# EAGLE design Solar battery (EAGLE 9.6.2)
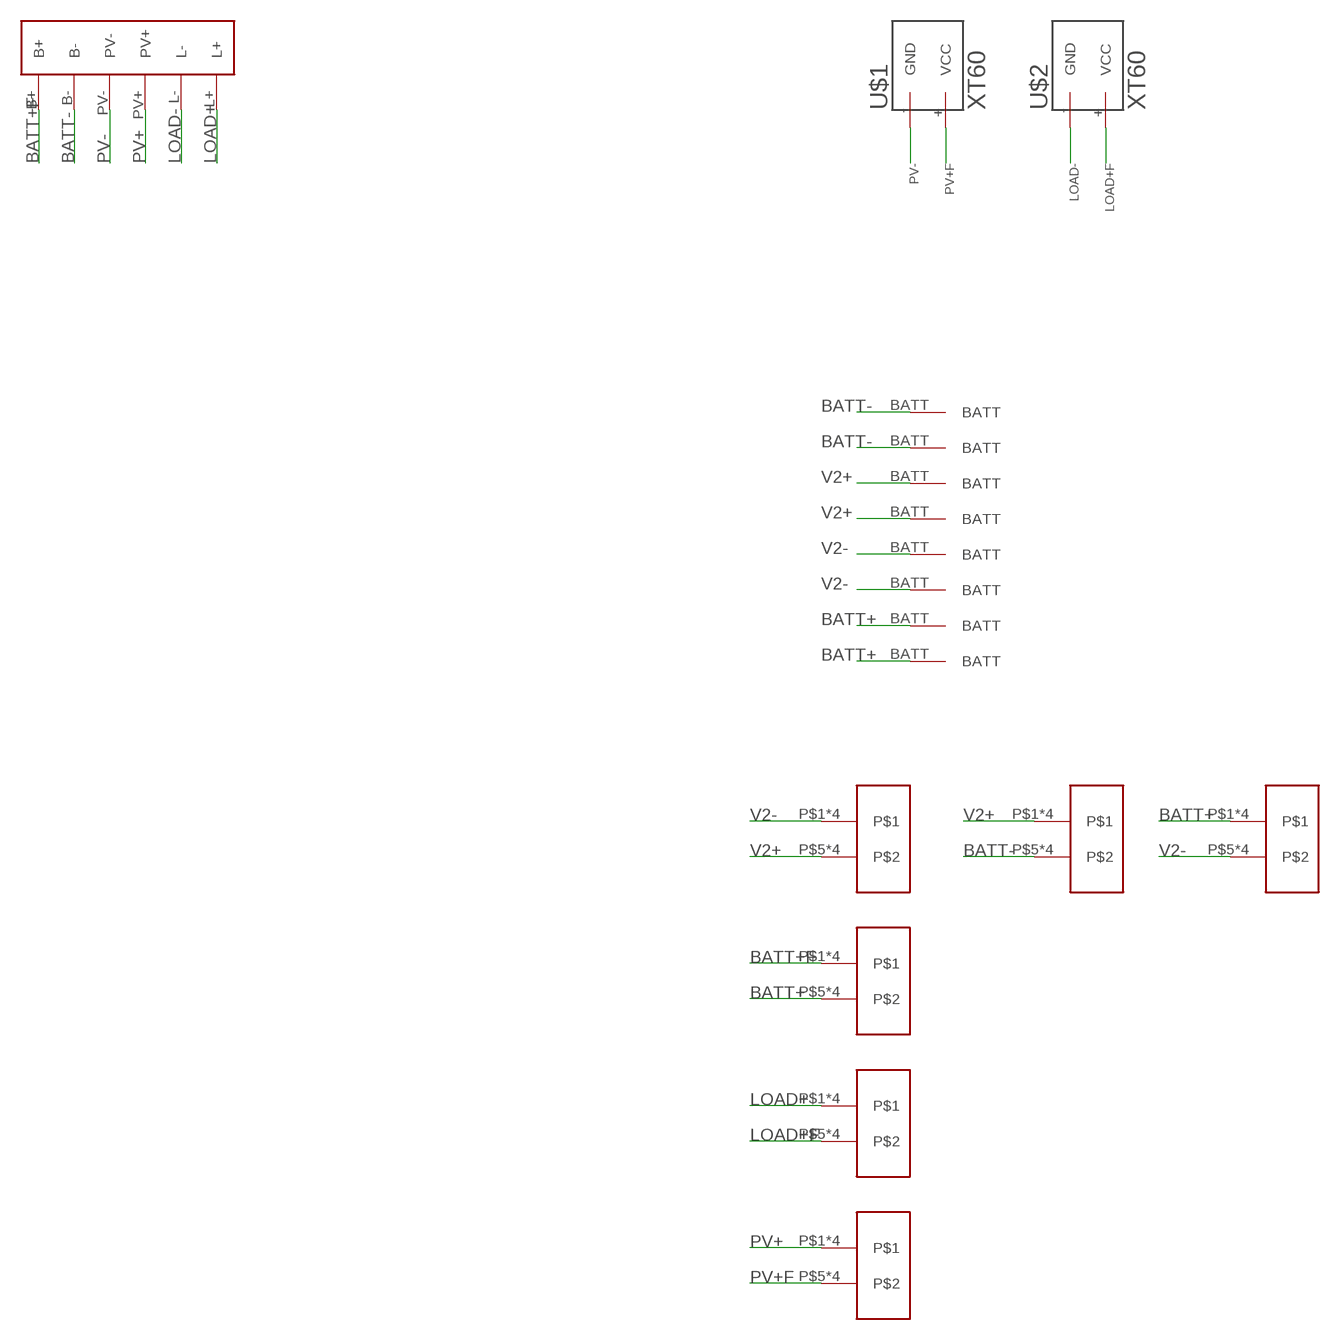
[diagram p0: schematic, sheet 1]

## Parts
U$1  XT60  [XT60]
U$2  XT60  [XT60]
U$3  C40_40135  [C40_40135]
U$4  C40_40135  [C40_40135]
U$5  C40_40135  [C40_40135]
U$6  C40_40135  [C40_40135]
U$7  C40_40135  [C40_40135]
U$8  C40_40135  [C40_40135]
U$9  C40_40135  [C40_40135]
U$10  C40_40135  [C40_40135]
U$11  FUSEHOLDER_178.6164  [FUSEHOLDER_178.6164]
U$12  FUSEHOLDER_178.6164  [FUSEHOLDER_178.6164]
U$13  FUSEHOLDER_178.6164  [FUSEHOLDER_178.6164]
U$14  FUSEHOLDER_178.6164  [FUSEHOLDER_178.6164]
U$15  FUSEHOLDER_178.6164  [FUSEHOLDER_178.6164]
U$16  FUSEHOLDER_178.6164  [FUSEHOLDER_178.6164]
U$17  SMARTSOLAR_75/15  [SMARTSOLAR_75/15]

## Nets
BATT+: U$9.BATT U$10.BATT U$12.P$5 U$12.P$6 U$12.P$7 U$12.P$8 U$16.P$1 U$16.P$2 U$16.P$3 U$16.P$4
BATT+F: U$12.P$1 U$12.P$2 U$12.P$3 U$12.P$4 U$17.B+
BATT-: U$3.BATT U$4.BATT U$15.P$5 U$15.P$6 U$15.P$7 U$15.P$8 U$17.B-
LOAD+: U$13.P$1 U$13.P$2 U$13.P$3 U$13.P$4 U$17.L+
LOAD+F: U$2.+(VCC) U$13.P$5 U$13.P$6 U$13.P$7 U$13.P$8
LOAD-: U$2.-(GND) U$17.L-
PV+: U$14.P$1 U$14.P$2 U$14.P$3 U$14.P$4 U$17.PV+
PV+F: U$1.+(VCC) U$14.P$5 U$14.P$6 U$14.P$7 U$14.P$8
PV-: U$1.-(GND) U$17.PV-
V2+: U$5.BATT U$6.BATT U$11.P$5 U$11.P$6 U$11.P$7 U$11.P$8 U$15.P$1 U$15.P$2 U$15.P$3 U$15.P$4
V2-: U$7.BATT U$8.BATT U$11.P$1 U$11.P$2 U$11.P$3 U$11.P$4 U$16.P$5 U$16.P$6 U$16.P$7 U$16.P$8

## Library data of the parts
U$1 U$2 = XT60:XT60: XT60
U$3-U$10 = Solar battery:C40_40135: C40 40135 Battery
U$11-U$16 = Solar battery:FUSEHOLDER_178.6164
U$17 = Solar battery:SMARTSOLAR_75/15

## Board
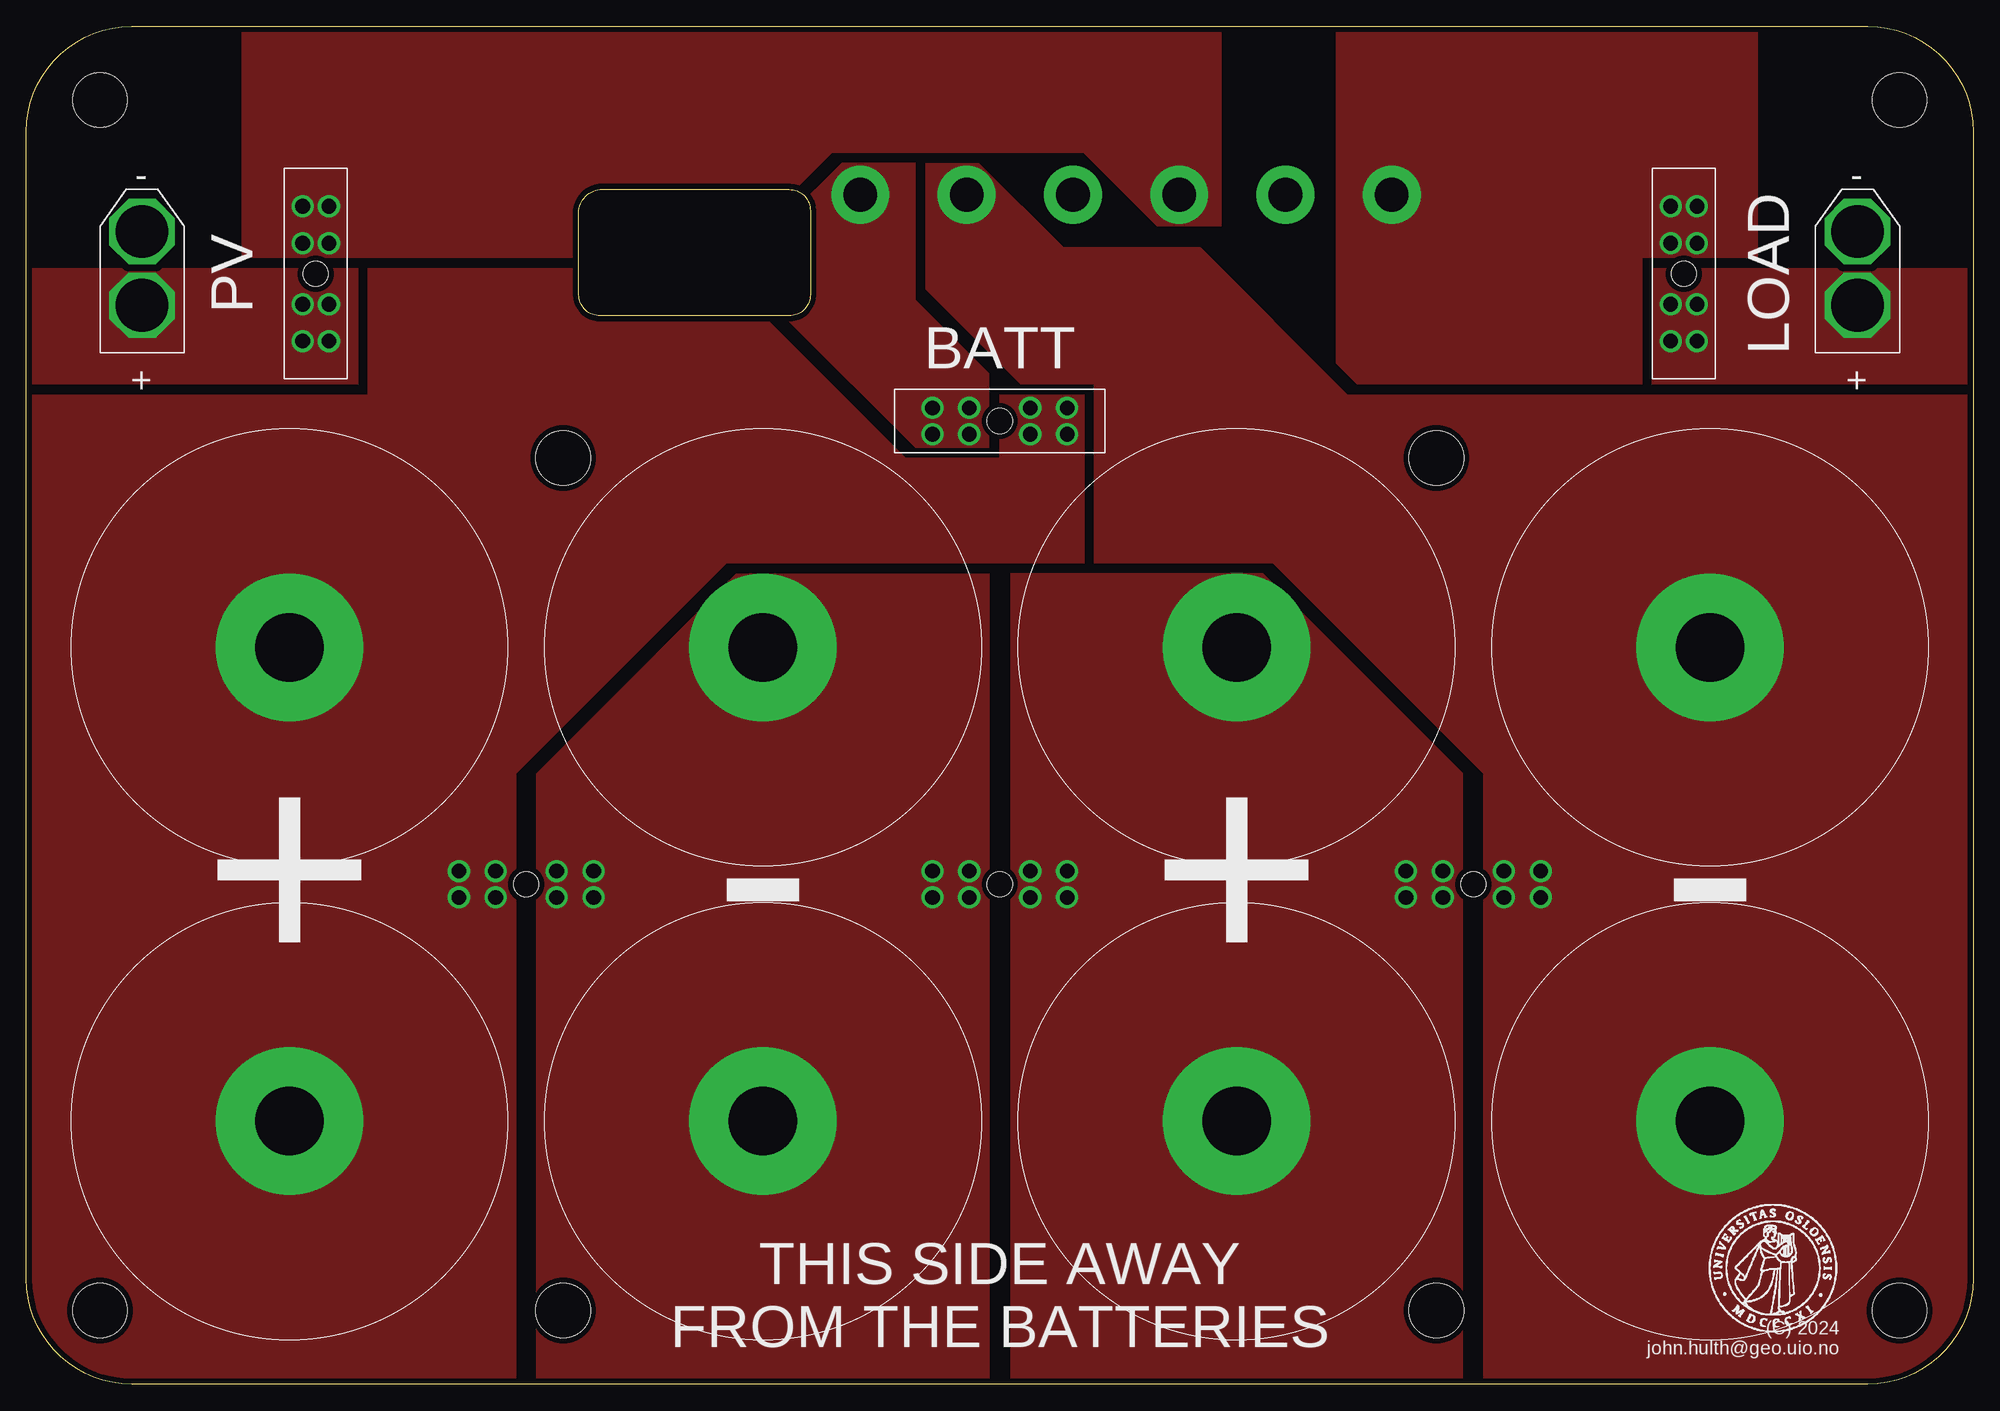
[diagram p1: board, top side]
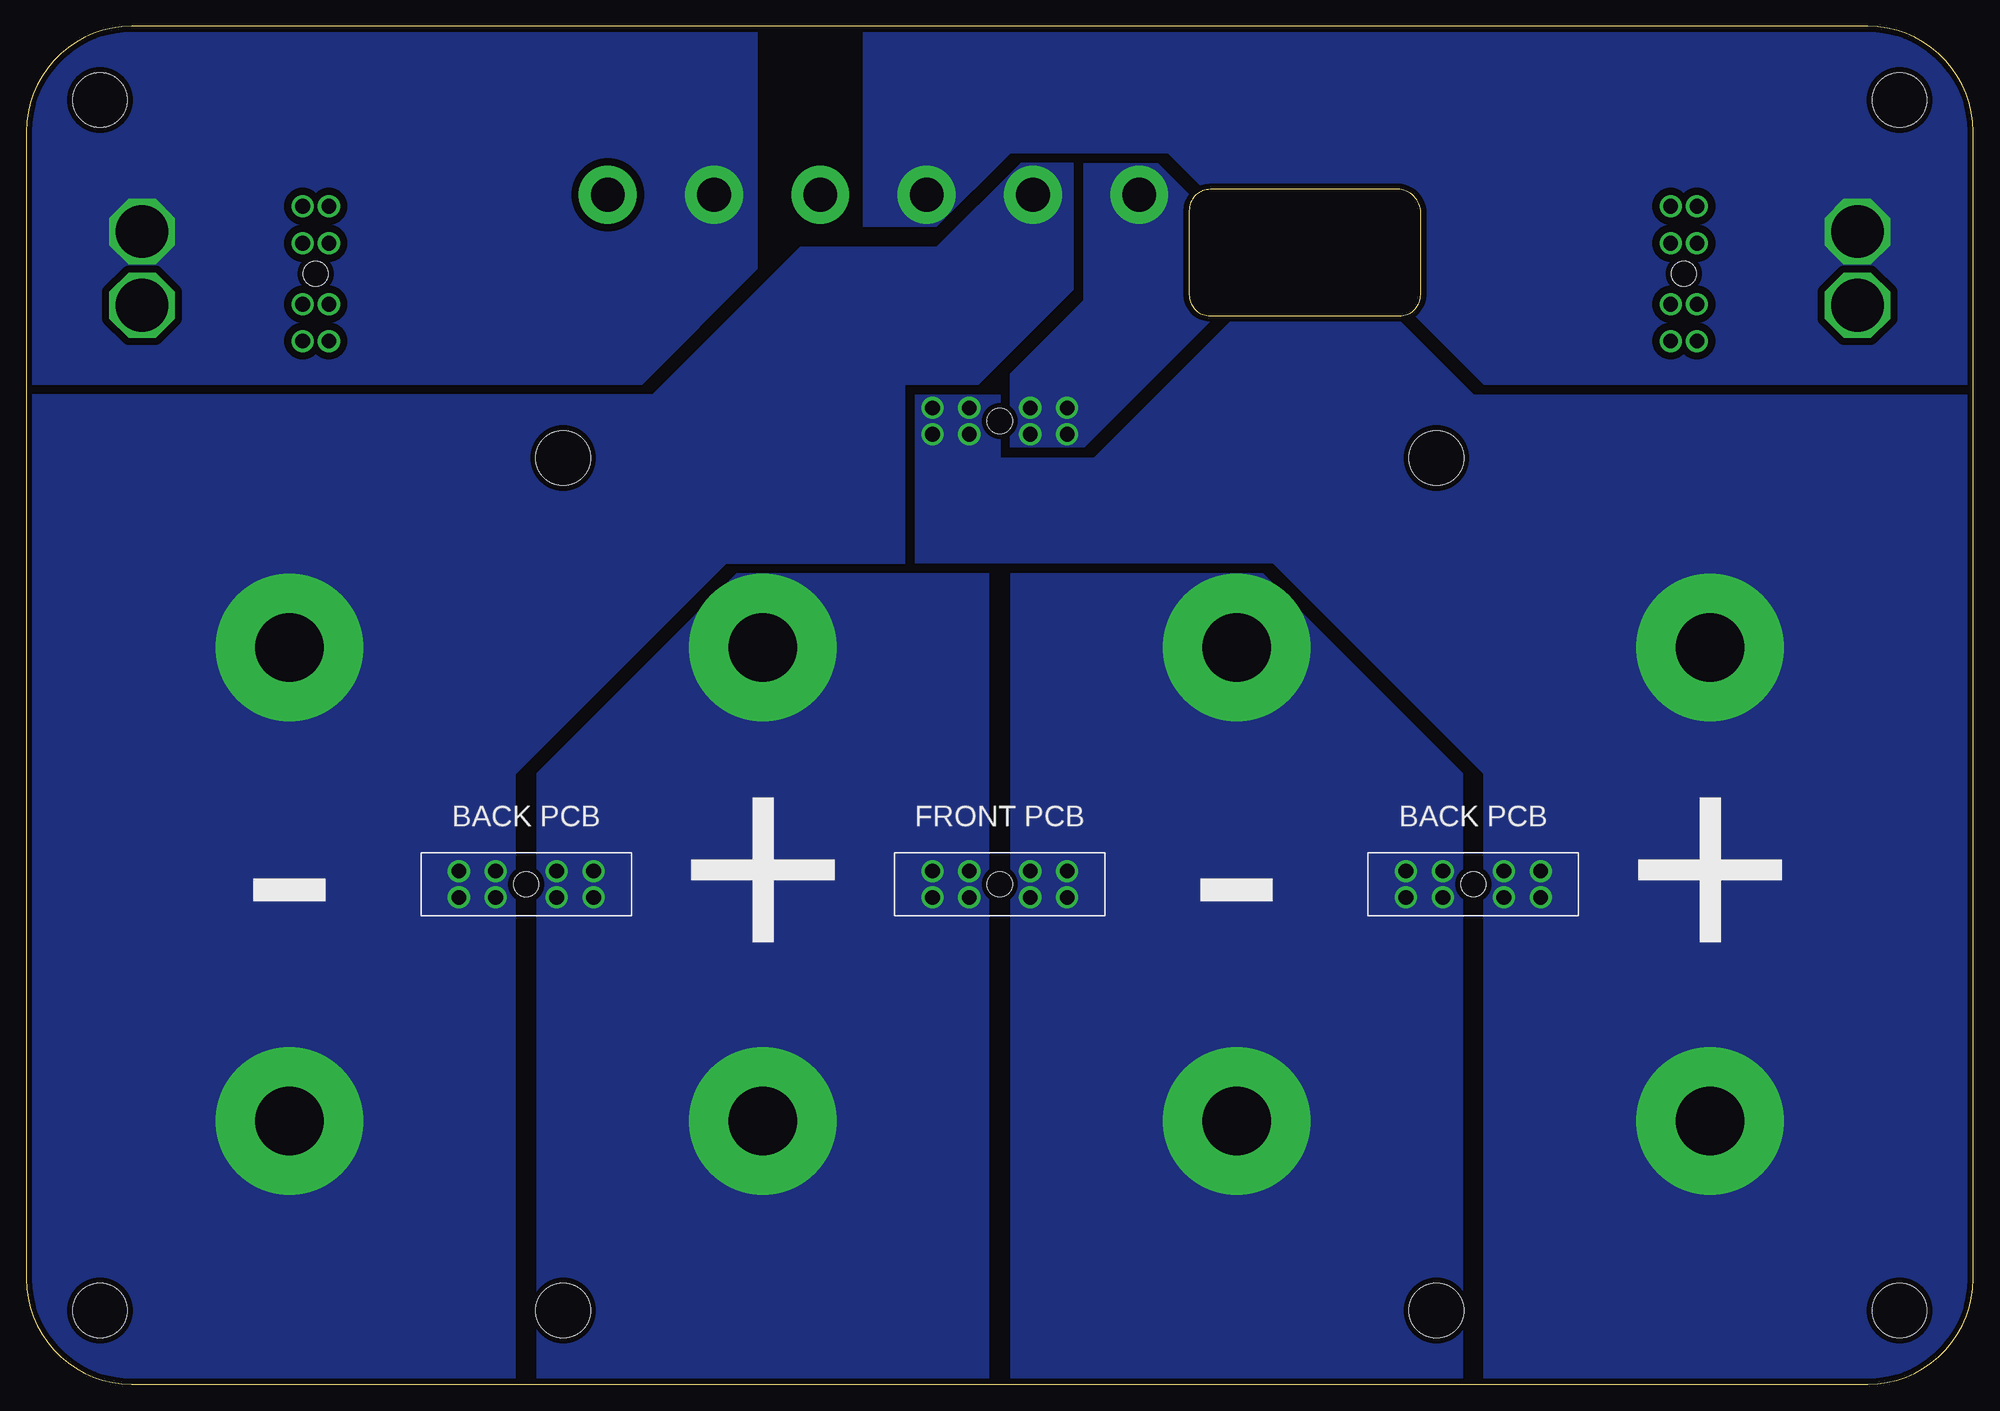
[diagram p2: board, bottom side, seen from below]

Size 185 x 129 mm. Coordinates in mm from the lower left corner, seen from the top.
Outline: 10,129 175,129 arc-90 185,119 185,10 arc-90 175,0 10,0 arc-90 0,10 0,119 arc-90 10,129
Outline: 54.5,113.5 72.5,113.5 arc-90 74.5,111.5 74.5,103.5 arc-90 72.5,101.5 54.5,101.5 arc-90 52.5,103.5 52.5,111.5 arc-77 54.5,113.5
Copper layers (1*16): Top 0.035mm / dielectric 1.5mm / Bottom 0.035mm
Design rules "default *": minimum track width 6mil, minimum drill 0.35mm, track to track 0.7mm, track to pad 0.7mm, pad to pad 0.7mm, via to via 0.7mm, smd to smd 0.7mm, copper to edge 0.5mm, drill to drill 1mm, minimum pad ring 10mil, minimum via ring 8mil, stop-mask expansion 4mil, vias tented up to drill 0mil, thermal gap 10mil
Holes 5.2 mm at 7,7 7,122 51,88 51,7 134,7 178,7 134,88 178,122

### Footprints (pad centres in the part's own frame; a part is rotated, then mirrored left to right if it is on the bottom)
XT60 = drill 5 pad 6.2 octagon: + 4.5,0; - 11.5,0
C40_40135 = drill 6.5 pad 14: BATT 0,0
FUSEHOLDER_178.6164 = drill 1.4: P$1 -6.4,1.25; P$2 -6.4,-1.25; P$3 -2.9,1.25; P$4 -2.9,-1.25; P$5 2.9,1.25; P$6 2.9,-1.25; P$7 6.4,1.25; P$8 6.4,-1.25 | hole 2.4: 0,0
SMARTSOLAR_75/15 = drill 3.2 pad 5.5: B+ 0,0; B- 10.1,0; L+ 50.5,0; L- 40.4,0; PV+ 30.3,0; PV- 20.2,0

### Placement (x,y rotation side)
U$1  11,98 90 top
U$2  174,98 90 top
U$3  160,70 0 top
U$4  160,25 0 top
U$5  115,70 0 top
U$6  115,25 0 top
U$7  70,70 0 top
U$8  70,25 0 top
U$9  25,70 0 top
U$10  25,25 0 top
U$11  92.5,47.5 180 bottom
U$12  92.5,91.5 0 top
U$13  157.5,105.5 270 top
U$14  27.5,105.5 270 top
U$15  137.5,47.5 180 bottom
U$16  47.5,47.5 180 bottom
U$17  79.25,113 0 top
U$18  [UIO-LOGO-BL]  159.65,4.69 0 top

### Tracks (layer width: path | path; a pad name or v marks a point on that pad's centre or on a via)
BATT+
  pour Top (no thermals): 92.5,94 100.5,94 100.5,78 66.5,78 46.5,58 46.5,0 0,0 0,94 32.5,94 32.5,106 65.5,106 83.5,88 92.5,88
  pour Bottom (no thermals): 100.5,78 100.5,94 92.5,94 92.5,88 83.5,88 65.5,106 59.5,106 47.5,94 0,94 0,0 46.5,0 46.5,58 66.5,78
BATT+F
  pour Top (no thermals): 91.5,89 91.5,96 84.5,103 84.5,116 77.5,116 72.5,111 72.5,101 84.5,89
  pour Bottom (no thermals): 84.5,116 77.5,116 67.5,106 84.5,89 91.5,89 91.5,96 84.5,103
BATT-
  pour Top (no thermals): 85.5,116 90.5,116 98.5,108 111.5,108 125.5,94 185,94 185,0 138.5,0 138.5,58 118.5,78 101.5,78 101.5,95 94.5,95 85.5,104
  pour Bottom (no thermals): 85.5,116 90.5,116 98.5,108 111.5,108 125.5,94 185,94 185,0 138.5,0 138.5,58 118.5,78 101.5,78 101.5,95 94.5,95 85.5,104
LOAD+
  pour Top (no thermals): 126.5,95 124.5,97 124.5,129 164.5,129 164.5,107 153.5,107 153.5,95
LOAD+F
  pour Top (no thermals): 154.5,106 185,106 185,95 154.5,95
LOAD-
  pour Bottom (no thermals): 126.5,95 115.5,106 115.5,129 185,129 185,95
PV+
  pour Top (no thermals): 113.5,129 113.5,110 107.5,110 100.5,117 76.5,117 66.5,107 20.5,107 20.5,129
PV+F
  pour Top (no thermals): 0,106 31.5,106 31.5,95 0,95
PV-
  pour Bottom (no thermals): 76.5,117 66.5,107 58.5,107 46.5,95 0,95 0,129 105.5,129 105.5,110 98.5,110 91.5,117
V2+
  pour Top (no thermals): 93.5,77 93.5,0 136.5,0 136.5,58 117.5,77
  pour Bottom (no thermals): 93.5,0 93.5,77 117.5,77 136.5,58 136.5,0
V2-
  pour Top (no thermals): 48.5,0 48.5,58 67.5,77 91.5,77 91.5,0
  pour Bottom (no thermals): 48.5,0 48.5,58 67.5,77 91.5,77 91.5,0

### Text on the board
tPlace: (C) 2024 / john.hulth@geo.uio.no
tNames: PV | LOAD | BATT | + | - | + | - | THIS SIDE AWAY / FROM THE BATTERIES
bNames: BACK PCB | FRONT PCB | BACK PCB | + | - | + | -